# Altium project Handheld Teensy 3.6 Logger.PrjPcb
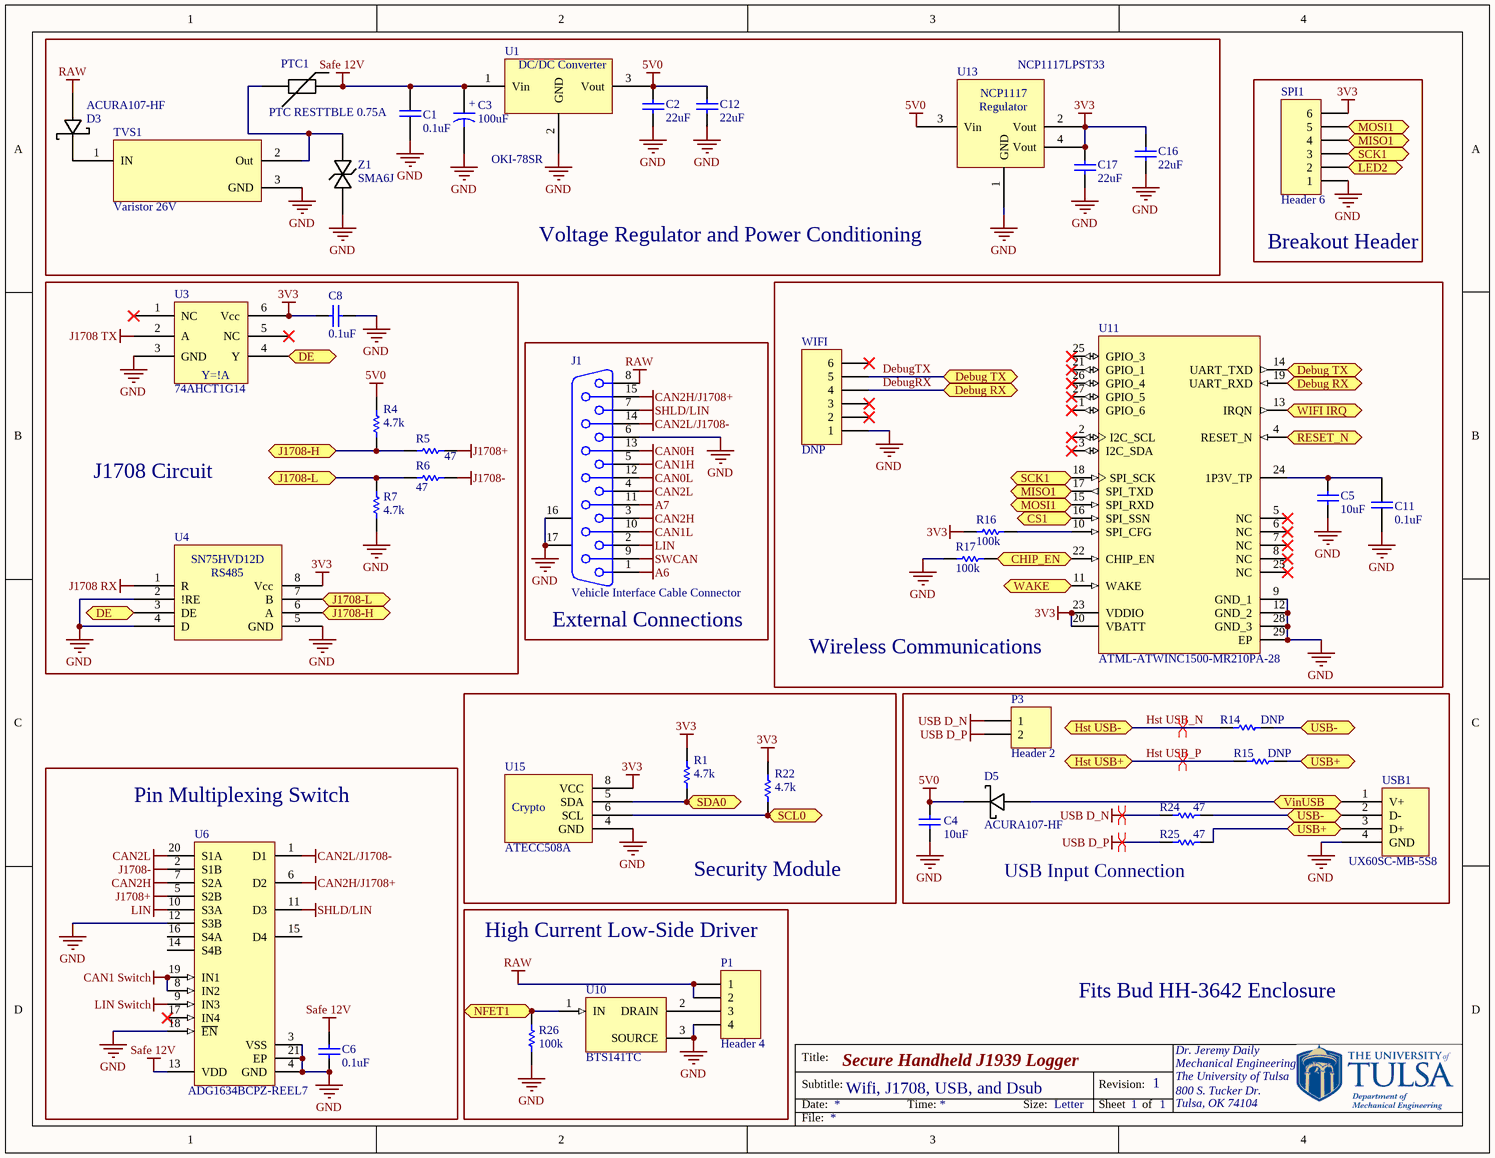
[diagram p0: Additional Circuits - Handheld - Rev 2.SchDoc]
2 sheets, 81 parts. Net scope: flat (ports and power ports of the same name join across sheets).
Board file: Handheld Logger Bud HH3642 rev3.PcbDoc
Sheets:
  Additional Circuits - Handheld - Rev 2.SchDoc
  Teensy 3.6 with J1939 - Handheld Rev2.SchDoc

## Sheet Additional Circuits - Handheld - Rev 2.SchDoc: Secure Handheld J1939 Logger
size Letter; Author: Dr. Jeremy Daily; CompanyName: The University of Tulsa; Organization: Mechanical Engineering; Address1: 800 S. Tucker Dr.; Address2: Tulsa, OK 74104; DocumentNumber: Wifi, J1708, USB, and Dsub; Revision: 1; SheetNumber: 1; SheetTotal: 1

### Parts
C1  0.1uF  [0603]
C2  22uF  [1206]
C3  100uF  [Elec. Cap - G]
C4  10uF  [0603]
C5  10uF  [1206]
C6  0.1uF  [0603]
C8  0.1uF  [0603]
C11  0.1uF  [0603]
C12  22uF  [1206]
C16  22uF  [1206]
C17  22uF  [1206]
D3  ACURA107-HF  [SMA with A and K]
D5  ACURA107-HF  [SMA with A and K]
J1  Vehicle Interface Cable Connector  [DSUB1.385-2H15]
P1  Header 4  [HDR1X4]
P3  Header 2  [HDR1X2]
PTC1  PTC RESTTBLE 0.75A  [1812]
R1  4.7k  [0603]
R4  4.7k  [0603]
R5  47  [0603]
R6  47  [0603]
R7  4.7k  [0603]
R14  DNP  [0603]
R15  DNP  [0603]
R16  100k  [0603]
R17  100k  [0603]
R22  4.7k  [0603]
R24  47  [0603]
R25  47  [0603]
R26  100k  [0603]
SPI1  Header 6  [HDR1X6]
TVS1  Varistor 26V  [Transfeed]
U1  OKI-78SR  [OKI-78SR]
U3  74AHCT1G14  [SOT-353]
U4  SN75HVD08DR  [SOIC-SN8_N]  (value not drawn)
U6  ADG1634BCPZ-REEL7  [ADI-CP-20-4_N]
U10  BTS141TC  [INF-PG-TO263-3-2_N]
U11  ATML-ATWINC1500-MR210PA-28  [ATML-ATWINC1500-MR210PA-28_V]
U13  NCP1117LPST33  [SOT-223]
U15  ATECC508A  [SOIC-8]
USB1  UX60SC-MB-5S8  [USB Mini UX60S]
WIFI  DNP  [HDR1X6]
Z1  SMA6J  [SMA]

### Blocks framed on the sheet
Voltage Regulator and Power Conditioning: C1-C3 C12 C16 C17 D3 PTC1 TVS1 U1 U13 Z1
Breakout Header: SPI1
J1708 Circuit: C8 R4-R7 U3 U4
Wireless Communications: C5 C11 R16 R17 U11 WIFI
External Connections: J1
Security Module: R1 R22 U15
USB Input Connection: C4 D5 P3 R14 R15 R24 R25 USB1
Pin Multiplexing Switch: C6 U6
High Current Low-Side Driver: P1 R26 U10

### Ports
CHIP_EN, CS1, DE, Debug RX, Debug TX, Hst USB+, Hst USB-, J1708-H, J1708-L, LED2, MISO1, MOSI1, NFET1, RESET_N, SCK1, SCL0, SDA0, USB+, USB-, VinUSB, WAKE, WIFI IRQ

### Nets
3V3: C8.2 C16.2 C17.2 R1.1 R16.2 R22.1 SPI1.6 U3.6(Vcc) U4.8(Vcc) U11.20(VBATT) U11.23(VDDIO) U13.2(Vout) U13.4(Vout) U15.8(VCC)
5V0: C2.2 C4.1 C12.2 D5.2(K) R4.1 U1.3(Vout) U13.3(Vin)
A6: J1.1
A7: J1.11
CAN0H: J1.13
CAN0L: J1.12
CAN1 Switch: U6.8(IN2) U6.19(IN1)
CAN1H: J1.5
CAN1L: J1.10
CAN2H: J1.3 U6.7(S2A)
CAN2H/J1708+: J1.15 U6.6(D2)
CAN2L: J1.4 U6.20(S1A)
CAN2L/J1708-: J1.14 U6.1(D1)
GND: C1.1 C2.1 C3.2(-) C4.2 C5.1 C6.1 C8.1 C11.1 C12.1 C16.1 C17.1 J1.6 J1.16(MH1) J1.17(MH2) P1.4 R7.2 R17.2 R26.2 SPI1.1 TVS1.3(GND) U1.2(GND) U3.3(GND) U4.2(!RE) U4.4(D) U4.5(GND) U6.3(VSS) U6.4(GND) U6.12(S3B) U6.18(~{EN}) U6.21(EP) U10.3(SOURCE) U11.9(GND_1) U11.12(GND_2) U11.28(GND_3) U11.29(EP) U13.1(GND) U15.4(GND) USB1.4(GND) WIFI.1 Z1.1(A)
J1708 RX: U4.1(R)
J1708 TX: U3.2(A)
J1708+: R5.2 U6.5(S2B)
J1708-: R6.2 U6.2(S1B)
LIN: J1.2 U6.10(S3A)
LIN Switch: U6.9(IN3)
RAW: D3.1(A) J1.8 P1.1 P1.2
Safe 12V: C1.2 C3.1 C6.2 PTC1.2 U1.1(Vin) U6.13(VDD)
SHLD/LIN: J1.7 U6.11(D3)
SWCAN: J1.9
USB D_N: P3.1 R24.1
USB D_P: P3.2 R25.1
DebugRX: U11.19(UART_RXD) WIFI.4 ; port Debug RX
DebugTX: U11.14(UART_TXD) WIFI.5 ; port Debug TX
Hst USB_N: R14.1 ; port Hst USB-
Hst USB_P: R15.1 ; port Hst USB+
NetC5_2: C5.2 C11.2 U11.24(1P3V_TP)
NetC15_2: U11.4(RESET_N) ; port RESET_N
NetD2_1: SPI1.2 ; port LED2
NetD3_2: D3.2(K) TVS1.1(IN)
NetD4_1: R17.1 U11.22(CHIP_EN) ; port CHIP_EN
NetD5_1: D5.1(A) USB1.1(V+) ; port VinUSB
NetI2C_2: R22.2 U15.6(SCL) ; port SCL0
NetI2C_3: R1.2 U15.5(SDA) ; port SDA0
NetP1_3: P1.3 U10.2(DRAIN)
NetPTC1_1: PTC1.1 TVS1.2(Out) Z1.2(K)
NetR4_2: R4.2 R5.1 U4.6(A) ; port J1708-H
NetR6_1: R6.1 R7.1 U4.7(B) ; port J1708-L
NetR14_2: R14.2 R24.2 USB1.2(D-) ; port USB-
NetR15_2: R15.2 R25.2 USB1.3(D+) ; port USB+
NetR16_1: R16.1 U11.10(SPI_CFG)
NetR26_1: R26.1 U10.1(IN) ; port NFET1
NetSPI1_3: SPI1.3 U11.18(SPI_SCK) ; port SCK1
NetSPI1_4: SPI1.4 U11.17(SPI_TXD) ; port MISO1
NetSPI1_5: SPI1.5 U11.15(SPI_RXD) ; port MOSI1
NetTeensy_1_30: U11.13(IRQN) ; port WIFI IRQ
NetTeensy_1_45: U11.16(SPI_SSN) ; port CS1
NetTeensy_1_63: U11.11(WAKE) ; port WAKE
NetU3_4: U3.4(Y) U4.3(DE) ; port DE

Not connected (* = marked no-connect by the designer): U3 1(NC)* 5(NC)*; U6 14(S4B) 15(D4) 16(S4A) 17(IN4)*; U11 1(GPIO_6)* 2(I2C_SCL)* 3(I2C_SDA)* 5(NC)* 6(NC)* 7(NC)* 8(NC)* 21(GPIO_1)* 25(NC)* 26(GPIO_4)* 27(GPIO_5)*; WIFI 2* 3* 6*

### Layout directives
differential pair: Hst USB_N, Hst USB_P, USB D_N, USB D_P

### Notes on the sheet
- Fits Bud HH-3642 Enclosure
- Title:
- Subtitle:
- Date:
- Time:
- Size:
- Letter
- Revision:
- Sheet
- of
- File:
- (in symbol 74AHCT1G14 Inverter) Y=!A
- (in symbol 7805) DC/DC Converter
- (in symbol ATECC508A) Crypto
- (in symbol NCP1117 2.5V) NCP1117; Regulator
- (in symbol SN75HVD12D (3.3v RS485)) SN75HVD12D; RS485
- (in symbol Tantalum Cap_1) +

### Library data of the parts
C1 C11 = Cap: CAP CER 0.1UF 50V X7R 0603; Manufacturer: Murata Electronics North America; PartNumber: GRM188R71H104KA93D; Supplier 1: Digi-Key; Supplier Part Number 1: 490-1519-1-ND
C2 C12 C16 C17 = Cap: 22µF ±20% 25V Ceramic Capacitor X5R 1206 (3216 Metric); Manufacturer: Murata Electronics North America; PartNumber: GRT31CR61E226ME01L; Supplier 1: Digi-Key; Supplier Part Number 1: 490-12451-1-ND
C3 = Tantalum Cap_1: Aluminum Electrolytic Capacitors Radial, Can - SMD 5000 Hrs @ 105°C; Manufacturer: Panasonic Electronic Components; PartNumber: EEE-HC1H101P; Supplier 1: Digi-Key; Supplier Part Number 1: P19732CT-ND
C4 = Cap: 10µF ±20% 25V Ceramic Capacitor X5R 0603 (1608 Metric); Manufacturer: Murata Electronics North America; PartNumber: GRT188R61E106ME13D; Supplier 1: Digi-Key; Supplier Part Number 1: 490-12323-1-ND
C5 = Cap: 10µF ±20% 50V Ceramic Capacitor X5R 1206 (3216 Metric); Manufacturer: Murata Electronics North America; PartNumber: GRT31CR61H106ME01L; Supplier 1: Digi-Key; Supplier Part Number 1: 490-12457-1-ND
C6 C8 = Cap: CAP CER 0.1UF 50V 10% X7R 0603; Manufacturer: Murata Electronics North America; PartNumber: GRM188R71H104KA93D; Supplier 1: Digi-Key; Supplier Part Number 1: 490-1519-1-ND
D3 D5 = Schottky Diode: Diode Schottky 1000V 1A Surface Mount DO-214AC (SMA); Manufacturer: Comchip Technology; Supplier 1: Digi-Key; Supplier Part Number 1: 641-1884-1-ND; PartNumber: ACURA107-HF
J1 = D Connector 15: Receptacle Assembly, 15 Position, Right Angle; Manufacturer: Amphenol FCI; PartNumber: D15S33E4GV00LF; Supplier 1: Digi-Key; Supplier Part Number 1: 609-1498-ND
P1 = Header 4: Header, 4-Pin
P3 = Header 2: Header, 2-Pin
PTC1 = PTC: PTC RESTTBLE 0.75A 33V CHIP 1812; Manufacturer: Bel Fuse Inc.; PartNumber: 0ZCG0075BF2B; Supplier 1: Digi-Key; Supplier Part Number 1: 507-1765-1-ND
R1 R4 R7 R22 = Chip Resistor: ±1% 0.1W, 1/10W Chip Resistor 0603 (1608 Metric) Automotive AEC-Q200, High Voltage Thick Film; Manufacturer: Rohm Semiconductor; PartNumber: KTR03EZPF4701; Supplier 1: Digi-Key; Supplier Part Number 1: RHM4.7KAYCT-ND
R5 R6 R24 R25 = Chip Resistor: ±1% 0.1W, 1/10W Chip Resistor 0603 (1608 Metric) Automotive AEC-Q200, High Voltage Thick Film; Manufacturer: Rohm Semiconductor; PartNumber: KTR03EZPF47R0; Supplier 1: Digi-Key; Supplier Part Number 1: RHM47AYCT-ND
R14 R15 = Chip Resistor: RES SMD 47 OHM 1% 1/10W 0603; Manufacturer: Panasonic Electronic Components; PartNumber: ERJ-3EKF47R0V; Supplier 1: Digi-Key; Supplier Part Number 1: P47.0HCT-ND
R16 R17 R26 = Chip Resistor: ±1% 0.1W, 1/10W Chip Resistor 0603 (1608 Metric) Automotive AEC-Q200, High Voltage Thick Film; Manufacturer: Rohm Semiconductor; PartNumber: KTR03EZPF1003; Supplier 1: Digi-Key; Supplier Part Number 1: RHM100KAYCT-ND
SPI1 = Header 6: Header, 6-Pin
TVS1 = Transfeed: 34.5V 80A Varistor 1 Circuit Surface Mount 0805 (2012 Metric); Manufacturer: AVX; PartNumber: V2AF126C600Y2EDP; Supplier 1: Digi-Key; Supplier Part Number 1: 478-10038-1-ND
U1 = 7805: 5V DC/DC Converter (7805 replacement); Manufacturer: Murata Power Solutions Inc.; PartNumber: OKI-78SR-5/1.5-W36H-C; Supplier 1: Digi-Key; Supplier Part Number 1: 811-2692-ND
U3 = 74AHCT1G14 Inverter: IC SCHMIT-TRIGG INV GATE SOT353; Manufacturer: Diodes Incorporated; PartNumber: 74AHCT1G14SE-7; Supplier 1: Digi-Key; Supplier Part Number 1: 74AHCT1G14SE-7DICT-ND
U4 = SN75HVD12D (3.3v RS485): IC RS485 TXRX 3/5V 8-SOIC; Manufacturer: Texas Instruments; PartNumber: SN75HVD08DR; Supplier 1: Digi-Key; Supplier Part Number 1: 296-37893-1-ND
U6 = ADG1634BCPZ-REEL7: IC SWITCH QUAD SPDT 20LFCSP; Manufacturer: Analog Devices; Supplier 1: Digi-Key; Supplier Part Number 1: ADG1634BCPZ-REEL7CT-ND; PartNumber: ADG1634BCPZ-REEL7
U10 = BTS141TC: Smart Low-Side Power Switch HITFET, 60 V VDS, 12 A ID, -40 to 150 degC, PG-TO263-3-2, Reel, Green; Manufacturer: Infineon; Supplier 1: Digi-Key; Supplier Part Number 1: BTS141TCTR-ND; PartNumber: BTS141TC
U11 = ATML-ATWINC1500-MR210PA-28: SMARTCONNECT ATWINC1500B-MU-T MO; Manufacturer: Microchip Technologies; PartNumber: ATWINC1510-MR210PB1140; Supplier 1: Digi-Key; Supplier Part Number 1: ATWINC1510-MR210PB1140-ND
U13 = NCP1117 2.5V: Linear Voltage Regulator IC Positive Fixed Output 3.3V 1A SOT-223; Manufacturer: On Semiconductor; PartNumber: NCP1117LPST33T3G; Supplier 1: Digi-Key; Supplier Part Number 1: NCP1117LPST33T3GOSCT-ND
U15 = ATECC508A: Authentication Chip IC Networking and Communications 8-SOIC; Manufacturer: Microchip Technology; PartNumber: ATECC508A-SSHDA-T; Supplier Part Number 1: ATECC508A-SSHDA-TCT-ND; Supplier 1: Digi-Key
USB1 = USB-Rugged: USB - mini B USB 2.0 Receptacle Connector 5 Position Surface Mount, Right Angle; Through Hole; Manufacturer: Hirose; Supplier 1: Digi-Key; Supplier Part Number 1: H11589CT-ND; PartNumber: UX60SC-MB-5S8
WIFI = Header 6: CONN HEADER FEMALE 6POS .1" GOLD; Manufacturer: Sullins Connector Solutions; PartNumber: PPPC061LFBN-RC; Supplier 1: Digi-Key; Supplier Part Number 1: S7039-ND
Z1 = Zener - Bidirectional: TVS DIODE 20VWM 36.8VC SMA; Manufacturer: Micro Commercial Co; PartNumber: SMA6J24CA-TP; Supplier 1: Digi-Key; Supplier Part Number 1: SMA6J24CA-TPMSCT-ND

## Sheet Teensy 3.6 with J1939 - Handheld Rev2.SchDoc: Secure Handheld J1939 Logger
size Letter; Author: Dr. Jeremy Daily; CompanyName: The University of Tulsa; Organization: Mechanical Engineering; Address1: 800 S. Tucker Dr.; Address2: Tulsa, OK 74104; DocumentNumber: Hands-On Heavy Duty Networking; Revision: 1; SheetNumber: 1; SheetTotal: 1
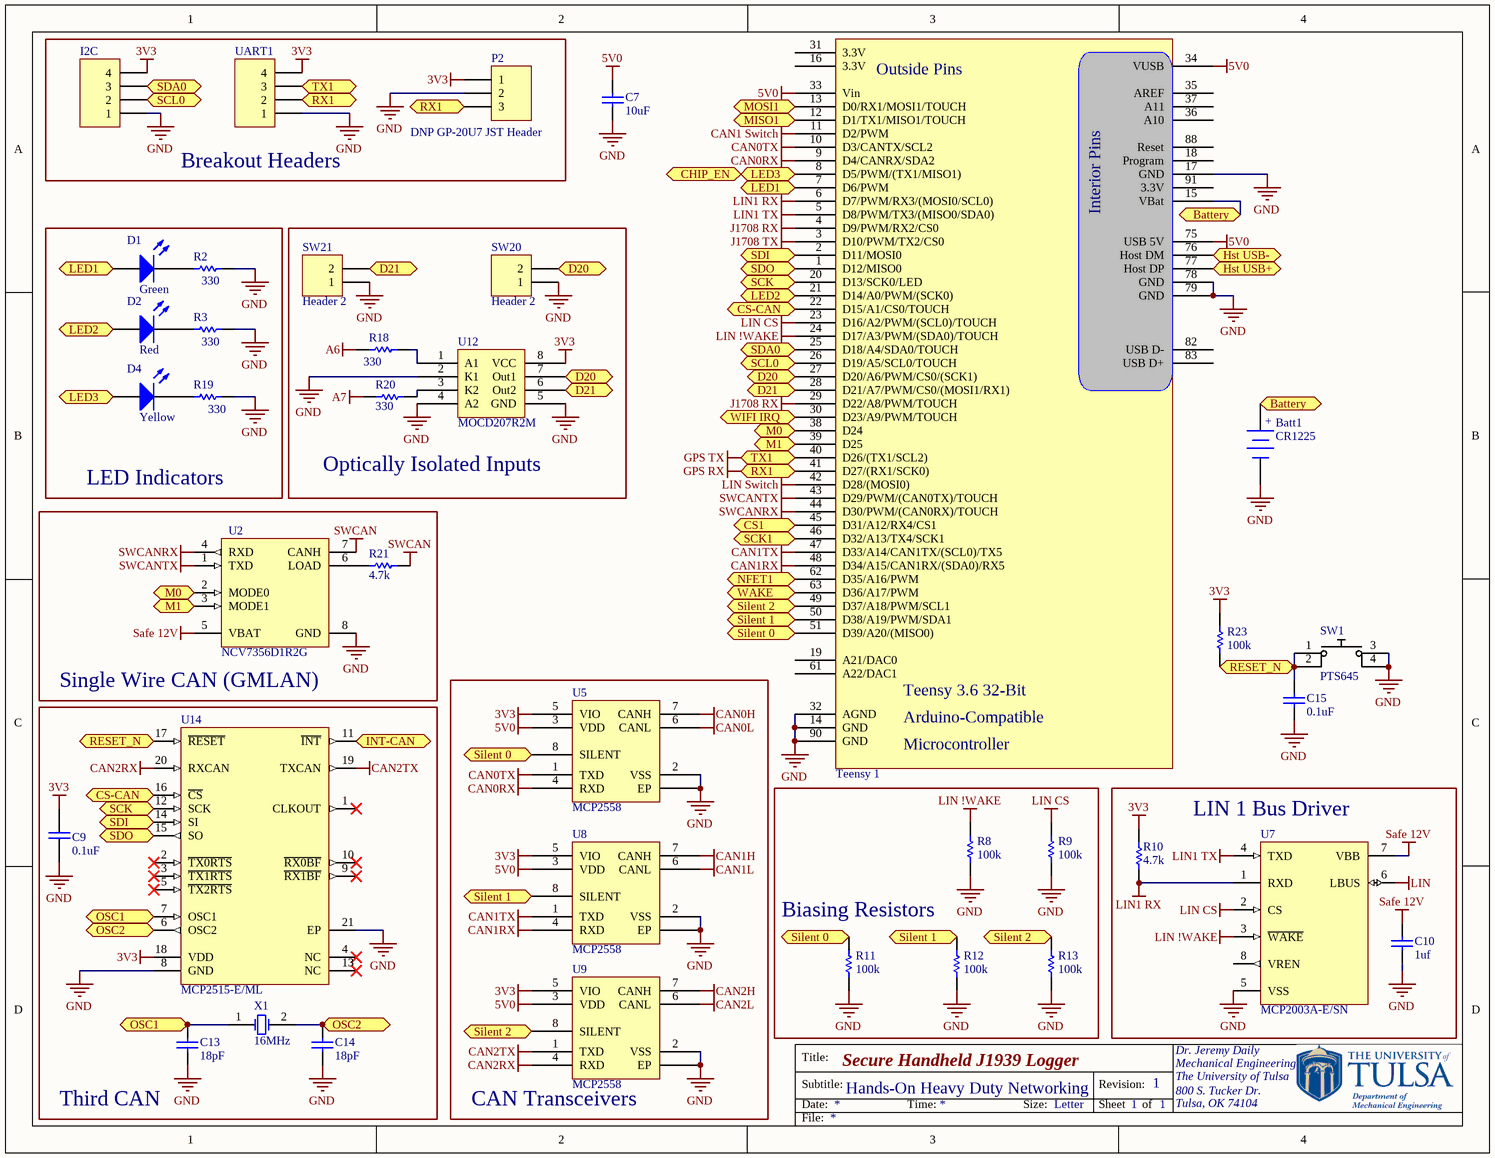
[diagram p1: Teensy 3.6 with J1939 - Handheld Rev2.SchDoc]

### Parts
Batt1  CR1225  [Battery Clip - CR1225]
C7  10uF  [1206]
C9  0.1uF  [0603]
C10  1uf  [0603]
C13  18pF  [0603]
C14  18pF  [0603]
C15  0.1uF  [0603]
D1  Green  [0805 Polarized]
D2  Red  [0805 Polarized]
D4  Yellow  [0805 Polarized]
I2C  Header 4  [HDR1X4]  (value not drawn)
P2  DNP GP-20U7 JST Header  [MHDR1X3]
R2  330  [0603]
R3  330  [0603]
R8  100k  [0603]
R9  100k  [0603]
R10  4.7k  [0603]
R11  100k  [0603]
R12  100k  [0603]
R13  100k  [0603]
R18  330  [0603]
R19  330  [0603]
R20  330  [0603]
R21  4.7k  [0603]
R23  100k  [0603]
SW1  PTS645  [Switch PTS645]
SW20  Header 2  [HDR1X2]
SW21  Header 2  [HDR1X2]
Teensy_1  Teensy 3.6 Through Hole  [Teensy 3.6 Through Hole - No Labels]  (value not drawn)
U2  NCV7356D1R2G  [ONSC-SOIC-8-751-07_V]
U5  MCP2558  [TDFN]
U7  MCP2003A-E/SN  [SOIC-SN8_N]
U8  MCP2558  [TDFN]
U9  MCP2558  [TDFN]
U12  MOCD207R2M  [SOIC-8]
U14  MCP2515-E/ML  [QFN-ML20_M]
UART1  Header 4  [HDR1X4]  (value not drawn)
X1  16MHz  [XTAL 2 pad]

### Blocks framed on the sheet
Breakout Headers: I2C P2 UART1
LED Indicators: D1 D2 D4 R2 R3 R19
Optically Isolated Inputs: R18 R20 SW20 SW21 U12
Single Wire CAN (GMLAN): R21 U2
CAN Transceivers: U5 U8 U9
Third CAN: C9 C13 C14 U14 X1
Biasing Resistors: R8 R9 R11-R13
LIN 1 Bus Driver: C10 R10 U7

### Ports
Battery, CHIP_EN, CS1, CS-CAN, D20, D21, Hst USB+, Hst USB-, INT-CAN, LED1, LED2, LED3, M0, M1, MISO1, MOSI1, NFET1, OSC1, OSC2, RESET_N, RX1, SCK, SCK1, SCL0, SDA0, SDI, SDO, Silent 0, Silent 1, Silent 2, TX1, WAKE, WIFI IRQ

### Nets
3V3: C9.2 I2C.4 P2.1 R10.2 R23.1 U5.5(VIO) U8.5(VIO) U9.5(VIO) U12.8(VCC) U14.18(VDD) UART1.4
5V0: C7.1 Teensy_1.33(Vin) Teensy_1.34(VUSB) Teensy_1.75(USB_5V) U5.3(VDD) U8.3(VDD) U9.3(VDD)
A6: R18.1
A7: R20.1
CAN0H: U5.7(CANH)
CAN0L: U5.6(CANL)
CAN0RX: Teensy_1.9(D4/CANRX/SDA2) U5.4(RXD)
CAN0TX: Teensy_1.10(D3/CANTX/SCL2) U5.1(TXD)
CAN1 Switch: Teensy_1.11(D2/PWM)
CAN1H: U8.7(CANH)
CAN1L: U8.6(CANL)
CAN1RX: Teensy_1.48(D34/A15/CAN1RX/(SDA0)/RX5) U8.4(RXD)
CAN1TX: Teensy_1.47(D33/A14/CAN1TX/(SCL0)/TX5) U8.1(TXD)
CAN2H: U9.7(CANH)
CAN2L: U9.6(CANL)
CAN2RX: U9.4(RXD) U14.20(RXCAN)
CAN2TX: U9.1(TXD) U14.19(TXCAN)
GND: Batt1.2(-) C7.2 C9.1 C10.2 C13.1 C14.1 C15.1 I2C.1 P2.2 R2.2 R3.2 R8.2 R9.2 R11.2 R12.2 R13.2 R19.2 SW1.3 SW1.4 SW20.1 SW21.1 Teensy_1.14(GND) Teensy_1.17(GND) Teensy_1.32(AGND) Teensy_1.78(GND) Teensy_1.79(GND) Teensy_1.90(GND) U2.8(GND) U5.0(EP) U5.2(VSS) U7.5(VSS) U8.0(EP) U8.2(VSS) U9.0(EP) U9.2(VSS) U12.2(K1) U12.4(A2) U12.5(GND) U14.8(GND) U14.21(EP) UART1.1
GPS RX: P2.3 Teensy_1.41(D27/(RX1/SCK0)) UART1.2 ; port RX1
GPS TX: Teensy_1.40(D26/(TX1/SCL2)) UART1.3 ; port TX1
J1708 RX: Teensy_1.4(D9/PWM/RX2/CS0) Teensy_1.29(D22/A8/PWM/TOUCH)
J1708 TX: Teensy_1.3(D10/PWM/TX2/CS0)
LIN: U7.6(LBUS)
LIN1 RX: R10.1 Teensy_1.6(D7/PWM/RX3/(MOSI0/SCL0)) U7.1(RXD)
LIN1 TX: Teensy_1.5(D8/PWM/TX3/(MISO0/SDA0)) U7.4(TXD)
LIN !WAKE: R8.1 Teensy_1.24(D17/A3/PWM/(SDA0)/TOUCH) U7.3(~{WAKE})
LIN CS: R9.1 Teensy_1.23(D16/A2/PWM/(SCL0)/TOUCH) U7.2(CS)
LIN Switch: Teensy_1.42(D28/(MOSI0))
Safe 12V: C10.1 U2.5(VBAT) U7.7(VBB)
SWCAN: R21.2 U2.7(CANH)
SWCANRX: Teensy_1.44(D30/PWM/(CAN0RX)/TOUCH) U2.4(RXD)
SWCANTX: Teensy_1.43(D29/PWM/(CAN0TX)/TOUCH) U2.1(TXD)
Hst USB_N: Teensy_1.76(Host_DM) ; port Hst USB-
Hst USB_P: Teensy_1.77(Host_DP) ; port Hst USB+
NetBatt1_1: Batt1.1(+) Teensy_1.15(VBat) ; port Battery
NetC13_2: C13.2 U14.7(OSC1) X1.1(OSC1) ; port OSC1
NetC14_2: C14.2 U14.6(OSC2) X1.2(OSC2) ; port OSC2
NetC15_2: C15.2 R23.2 SW1.1 SW1.2 U14.17(~{RESET}) ; port RESET_N
NetD1_1: D1.1(A) Teensy_1.7(D6/PWM) ; port LED1
NetD1_2: D1.2(K) R2.1
NetD2_1: D2.1(A) Teensy_1.21(D14/A0/PWM/(SCK0)) ; port LED2
NetD2_2: D2.2(K) R3.1
NetD4_1: D4.1(A) Teensy_1.8(D5/PWM/(TX1/MISO1)) ; port LED3, port CHIP_EN
NetD4_2: D4.2(K) R19.1
NetI2C_2: I2C.2 Teensy_1.26(D19/A5/SCL0/TOUCH) ; port SCL0
NetI2C_3: I2C.3 Teensy_1.25(D18/A4/SDA0/TOUCH) ; port SDA0
NetR11_1: R11.1 Teensy_1.51(D39/A20/(MISO0)) U5.8(SILENT) ; port Silent 0
NetR12_1: R12.1 Teensy_1.50(D38/A19/PWM/SDA1) U8.8(SILENT) ; port Silent 1
NetR13_1: R13.1 Teensy_1.49(D37/A18/PWM/SCL1) U9.8(SILENT) ; port Silent 2
NetR18_2: R18.2 U12.1(A1)
NetR20_2: R20.2 U12.3(K2)
NetR21_1: R21.1 U2.6(LOAD)
NetR26_1: Teensy_1.62(D35/A16/PWM) ; port NFET1
NetSPI1_3: Teensy_1.46(D32/A13/TX4/SCK1) ; port SCK1
NetSPI1_4: Teensy_1.12(D1/TX1/MISO1/TOUCH) ; port MISO1
NetSPI1_5: Teensy_1.13(D0/RX1/MOSI1/TOUCH) ; port MOSI1
NetSW20_2: SW20.2 Teensy_1.27(D20/A6/PWM/CS0/(SCK1)) U12.7(Out1) ; port D20
NetSW21_2: SW21.2 Teensy_1.28(D21/A7/PWM/CS0/(MOSI1/RX1)) U12.6(Out2) ; port D21
NetTeensy_1_1: Teensy_1.1(D12/MISO0) U14.15(SO) ; port SDO
NetTeensy_1_2: Teensy_1.2(D11/MOSI0) U14.14(SI) ; port SDI
NetTeensy_1_20: Teensy_1.20(D13/SCK0/LED) U14.12(SCK) ; port SCK
NetTeensy_1_22: Teensy_1.22(D15/A1/CS0/TOUCH) U14.16(~{CS}) ; port CS-CAN
NetTeensy_1_30: Teensy_1.30(D23/A9/PWM/TOUCH) ; port WIFI IRQ
NetTeensy_1_38: Teensy_1.38(D24) U2.2(MODE0) ; port M0
NetTeensy_1_39: Teensy_1.39(D25) U2.3(MODE1) ; port M1
NetTeensy_1_45: Teensy_1.45(D31/A12/RX4/CS1) ; port CS1
NetTeensy_1_63: Teensy_1.63(D36/A17/PWM) ; port WAKE
NetU14_11: U14.11(~{INT}) ; port INT-CAN

Not connected (* = marked no-connect by the designer): Teensy_1 16(3.3V) 18(Program) 19(A21/DAC0) 31(3.3V) 35(AREF) 36(A10) 37(A11) 61(A22/DAC1) 82(USB_D-) 83(USB_D+) 88(Reset) 91(3.3V); U7 8(VREN); U14 1(CLKOUT)* 2(~{TX0RTS})* 3(~{TX1RTS})* 4(NC)* 5(~{TX2RTS})* 9(~{RX1BF})* 10(~{RX0BF})* 13(NC)*

### Notes on the sheet
- Title:
- Subtitle:
- Date:
- Time:
- Size:
- Letter
- Revision:
- Sheet
- of
- File:
- (in symbol Teensy 3.6 Through Hole) Outside Pins; Interior Pins; Teensy 3.6 32-Bit; Arduino-Compatible; Microcontroller

### Library data of the parts
Batt1 = CR2032 Battery Holder: Lithium Battery Non-Rechargeable (Primary) 3V Coin, 12.5mm; Manufacturer: Linx; PartNumber: BAT-HLD-012-SMT; Supplier 1: Digi-Key; Supplier Part Number 1: BAT-HLD-012-SMT-ND
C7 = Cap: as C5 on sheet Additional Circuits - Handheld - Rev 2; Supplier 1: Digi-Key; Supplier Part Number 1: 490-12457-1-ND
C9 = Cap: as C1 on sheet Additional Circuits - Handheld - Rev 2; Supplier 1: Digi-Key; Supplier Part Number 1: 490-1519-1-ND
C10 = Cap: 1µF ±20% 50V Ceramic Capacitor X5R 0603 (1608 Metric); Manufacturer: Murata Electronics North America; PartNumber: GRT188R61H105ME13D; Supplier 1: Digi-Key; Supplier Part Number 1: 490-12331-1-ND
C13 C14 = Cap: CAP CER 18PF 50V 5% NP0 0603; Manufacturer: Kemet; PartNumber: C0603C180J5GACTU; Supplier 1: Digi-Key; Supplier Part Number 1: 399-1052-1-ND
C15 = Cap: as C6 on sheet Additional Circuits - Handheld - Rev 2; Supplier 1: Digi-Key; Supplier Part Number 1: 490-1519-1-ND
D1 = LED - SMD: LED GREEN DIFFUSED 0805 SMD; Manufacturer: OSRAM Opto Semiconductors Inc.; PartNumber: LG R971-KN-1; Supplier 1: Digi-Key; Supplier Part Number 1: 475-1410-1-ND
D2 = LED - SMD: LED RED DIFFUSED 0805 SMD; Manufacturer: OSRAM Opto Semiconductors Inc.; PartNumber: LS R976-NR-1; Supplier 1: Digi-Key; Supplier Part Number 1: 475-1278-1-ND
D4 = LED - SMD: LED YELLOW DIFFUSED 0805 SMD; Manufacturer: OSRAM Opto Semiconductors Inc.; PartNumber: LY R976-PS-36; Supplier 1: Digi-Key; Supplier Part Number 1: 475-2560-1-ND
I2C UART1 = Header 4: Header, 4-Pin
P2 = MHDR1X3: CONN HEADER PH SIDE 3POS 2MM SMD; PartNumber: S3B-PH-SM4-TB(LF)(SN); Manufacturer: JST; Supplier 1: Digi-Key; Supplier Part Number 1: 455-1750-1-ND
R2 R3 R18-R20 = Chip Resistor: 330 Ohms ±1% 0.1W, 1/10W Chip Resistor 0603 (1608 Metric) Automotive AEC-Q200, High Voltage Thick Film; Manufacturer: Rohm Semiconductor; PartNumber: KTR03EZPF3300; Supplier 1: Digi-Key; Supplier Part Number 1: RHM330AYCT-ND
R8 R9 R11-R13 R23 = Chip Resistor: as R16 on sheet Additional Circuits - Handheld - Rev 2; Supplier 1: Digi-Key; Supplier Part Number 1: RHM100KAYCT-ND
R10 R21 = Chip Resistor: as R1 on sheet Additional Circuits - Handheld - Rev 2; Supplier 1: Digi-Key; Supplier Part Number 1: RHM4.7KAYCT-ND
SW1 = Switch - Tactile_1: PTS645 Series  6 mm Tact Switches; Manufacturer: C & K Components; PartNumber: PTS645SM43SMTR92 LFS; Supplier 1: Digi-Key; Supplier Part Number 1: CKN9112CT-ND
SW20 SW21 = Header 2: Header, 2-Pin
Teensy_1 = Teensy 3.6 Through Hole: 24 Position Header Connector 0.100" (2.54mm) Through Hole Gold; Manufacturer: Sullins Connector Solutions; PartNumber: PPPC241LFBN-RC; Supplier 1: Digi-Key; Supplier Part Number 1: S7057-ND
U2 = NCV7356D1G: Single Wire CAN Transceiver, 5 to 27 V, 8-Pin SOIC, Pb-Free, Tube; Manufacturer: On Semiconductor; Supplier 1: Digi-Key; Supplier Part Number 1: NCV7356D1R2GOSCT-ND; PartNumber: NCV7356D1R2G
U5 U8 U9 = MCP2558FD: Microchip CAN FD Transceiver with Silent Mode; PartNumber: MCP2558FDT-H/MNY; Manufacturer: Microchip; Supplier 1: Arrow; Supplier Part Number 1: MCP2558FDT-H/MNY
U7 = MCP2003AT-E/SN: LIN J2602 Transceiver, 8-Pin SOIC, Extended Temperature, Tape and Reel; Manufacturer: Microchip; Supplier 1: Digi-Key; Supplier Part Number 1: MCP2003A-E/SN-ND; PartNumber: MCP2003A-E/SN
U12 = Optoisolator - Dual: Optoisolator Transistor Output 2500Vrms 2 Channel 8-SO Tall; Manufacturer: Fairchild/ON Semiconductor; PartNumber: MOCD207R2M; Supplier 1: Digi-Key; Supplier Part Number 1: MOCD207R2MCT-ND
U14 = MCP2515-E/ML: CAN Controller CAN 2.0 SPI Interface 20-QFN (4x4); Manufacturer: Microchip; PartNumber: MCP2515-E/ML; Supplier 1: Digi-Key; Supplier Part Number 1: MCP2515-E/ML-ND
X1 = Crystal Oscillator: CRYSTAL 16MHZ 18PF SMD; Manufacturer: TXC CORPORATION; PartNumber: 7A-16.000MAAJ-T; Supplier 1: Digi-Key; Supplier Part Number 1: 887-1086-1-ND

## Nets that join several sheets
3V3: Additional Circuits - Handheld - Rev 2 (14 pins), Teensy 3.6 with J1939 - Handheld Rev2 (11 pins)
5V0: Additional Circuits - Handheld - Rev 2 (7 pins), Teensy 3.6 with J1939 - Handheld Rev2 (7 pins)
A6: Additional Circuits - Handheld - Rev 2 (J1.1), Teensy 3.6 with J1939 - Handheld Rev2 (R18.1)
A7: Additional Circuits - Handheld - Rev 2 (J1.11), Teensy 3.6 with J1939 - Handheld Rev2 (R20.1)
CAN0H: Additional Circuits - Handheld - Rev 2 (J1.13), Teensy 3.6 with J1939 - Handheld Rev2 (U5.7)
CAN0L: Additional Circuits - Handheld - Rev 2 (J1.12), Teensy 3.6 with J1939 - Handheld Rev2 (U5.6)
CAN1 Switch: Additional Circuits - Handheld - Rev 2 (U6.8 U6.19), Teensy 3.6 with J1939 - Handheld Rev2 (Teensy_1.11)
CAN1H: Additional Circuits - Handheld - Rev 2 (J1.5), Teensy 3.6 with J1939 - Handheld Rev2 (U8.7)
CAN1L: Additional Circuits - Handheld - Rev 2 (J1.10), Teensy 3.6 with J1939 - Handheld Rev2 (U8.6)
CAN2H: Additional Circuits - Handheld - Rev 2 (J1.3 U6.7), Teensy 3.6 with J1939 - Handheld Rev2 (U9.7)
CAN2L: Additional Circuits - Handheld - Rev 2 (J1.4 U6.20), Teensy 3.6 with J1939 - Handheld Rev2 (U9.6)
GND: Additional Circuits - Handheld - Rev 2 (40 pins), Teensy 3.6 with J1939 - Handheld Rev2 (41 pins)
J1708 RX: Additional Circuits - Handheld - Rev 2 (U4.1), Teensy 3.6 with J1939 - Handheld Rev2 (Teensy_1.4 Teensy_1.29)
J1708 TX: Additional Circuits - Handheld - Rev 2 (U3.2), Teensy 3.6 with J1939 - Handheld Rev2 (Teensy_1.3)
LIN: Additional Circuits - Handheld - Rev 2 (J1.2 U6.10), Teensy 3.6 with J1939 - Handheld Rev2 (U7.6)
LIN Switch: Additional Circuits - Handheld - Rev 2 (U6.9), Teensy 3.6 with J1939 - Handheld Rev2 (Teensy_1.42)
Safe 12V: Additional Circuits - Handheld - Rev 2 (6 pins), Teensy 3.6 with J1939 - Handheld Rev2 (C10.1 U2.5 U7.7)
SWCAN: Additional Circuits - Handheld - Rev 2 (J1.9), Teensy 3.6 with J1939 - Handheld Rev2 (R21.2 U2.7)
Hst USB_N: Additional Circuits - Handheld - Rev 2 (R14.1), Teensy 3.6 with J1939 - Handheld Rev2 (Teensy_1.76)
Hst USB_P: Additional Circuits - Handheld - Rev 2 (R15.1), Teensy 3.6 with J1939 - Handheld Rev2 (Teensy_1.77)
NetC15_2: Additional Circuits - Handheld - Rev 2 (U11.4), Teensy 3.6 with J1939 - Handheld Rev2 (5 pins)
NetD2_1: Additional Circuits - Handheld - Rev 2 (SPI1.2), Teensy 3.6 with J1939 - Handheld Rev2 (D2.1 Teensy_1.21)
NetD4_1: Additional Circuits - Handheld - Rev 2 (R17.1 U11.22), Teensy 3.6 with J1939 - Handheld Rev2 (D4.1 Teensy_1.8)
NetI2C_2: Additional Circuits - Handheld - Rev 2 (R22.2 U15.6), Teensy 3.6 with J1939 - Handheld Rev2 (I2C.2 Teensy_1.26)
NetI2C_3: Additional Circuits - Handheld - Rev 2 (R1.2 U15.5), Teensy 3.6 with J1939 - Handheld Rev2 (I2C.3 Teensy_1.25)
NetR26_1: Additional Circuits - Handheld - Rev 2 (R26.1 U10.1), Teensy 3.6 with J1939 - Handheld Rev2 (Teensy_1.62)
NetSPI1_3: Additional Circuits - Handheld - Rev 2 (SPI1.3 U11.18), Teensy 3.6 with J1939 - Handheld Rev2 (Teensy_1.46)
NetSPI1_4: Additional Circuits - Handheld - Rev 2 (SPI1.4 U11.17), Teensy 3.6 with J1939 - Handheld Rev2 (Teensy_1.12)
NetSPI1_5: Additional Circuits - Handheld - Rev 2 (SPI1.5 U11.15), Teensy 3.6 with J1939 - Handheld Rev2 (Teensy_1.13)
NetTeensy_1_30: Additional Circuits - Handheld - Rev 2 (U11.13), Teensy 3.6 with J1939 - Handheld Rev2 (Teensy_1.30)
NetTeensy_1_45: Additional Circuits - Handheld - Rev 2 (U11.16), Teensy 3.6 with J1939 - Handheld Rev2 (Teensy_1.45)
NetTeensy_1_63: Additional Circuits - Handheld - Rev 2 (U11.11), Teensy 3.6 with J1939 - Handheld Rev2 (Teensy_1.63)